# EAGLE schematic 64Pin-2 (EAGLE 7.2.0)
64 Pin Board to mount PIC24FJ1024GB606E
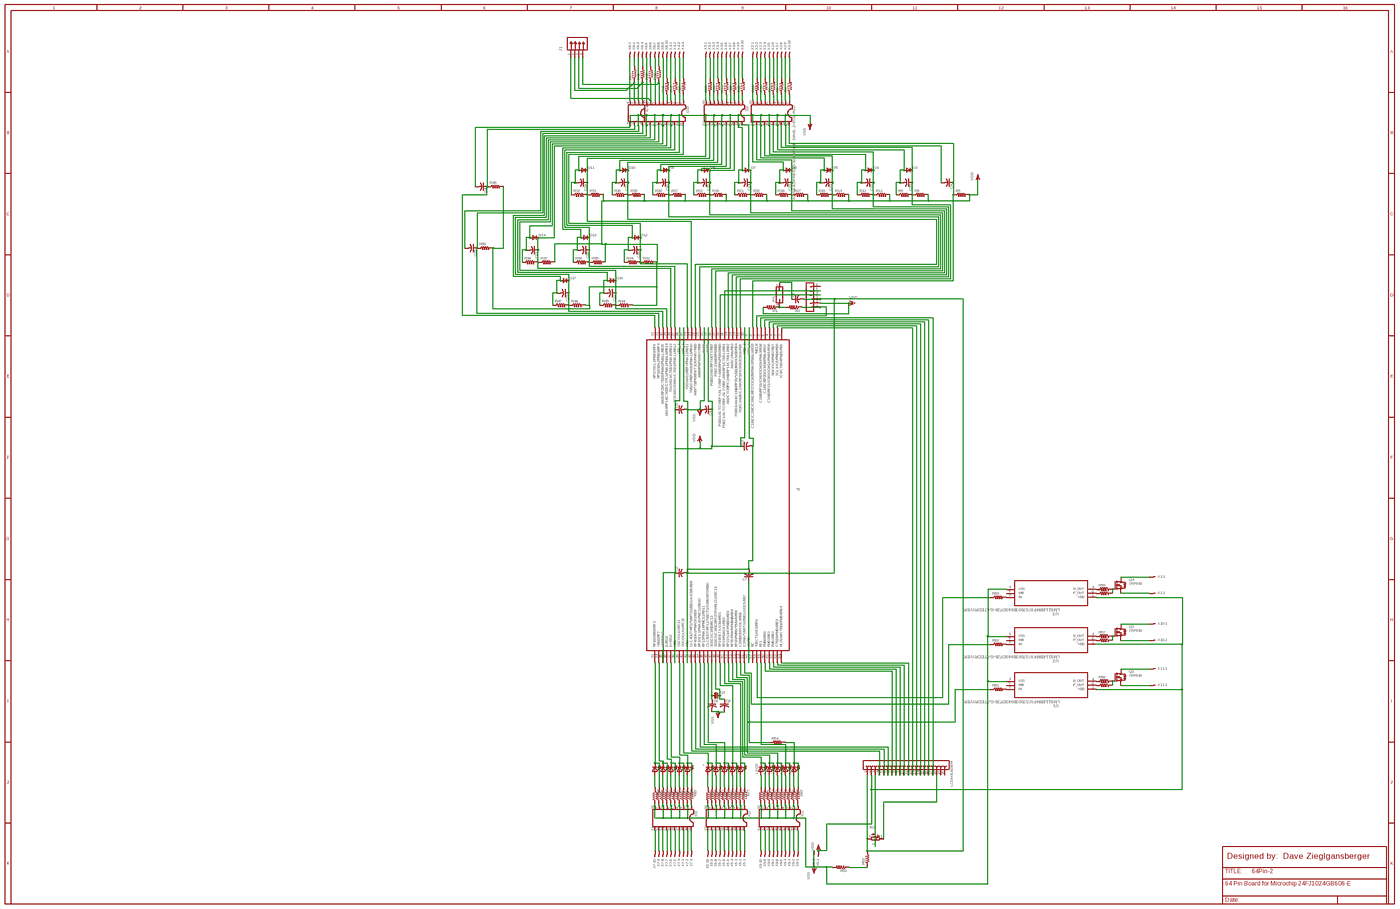
[diagram p0: schematic, sheet 1, overview]
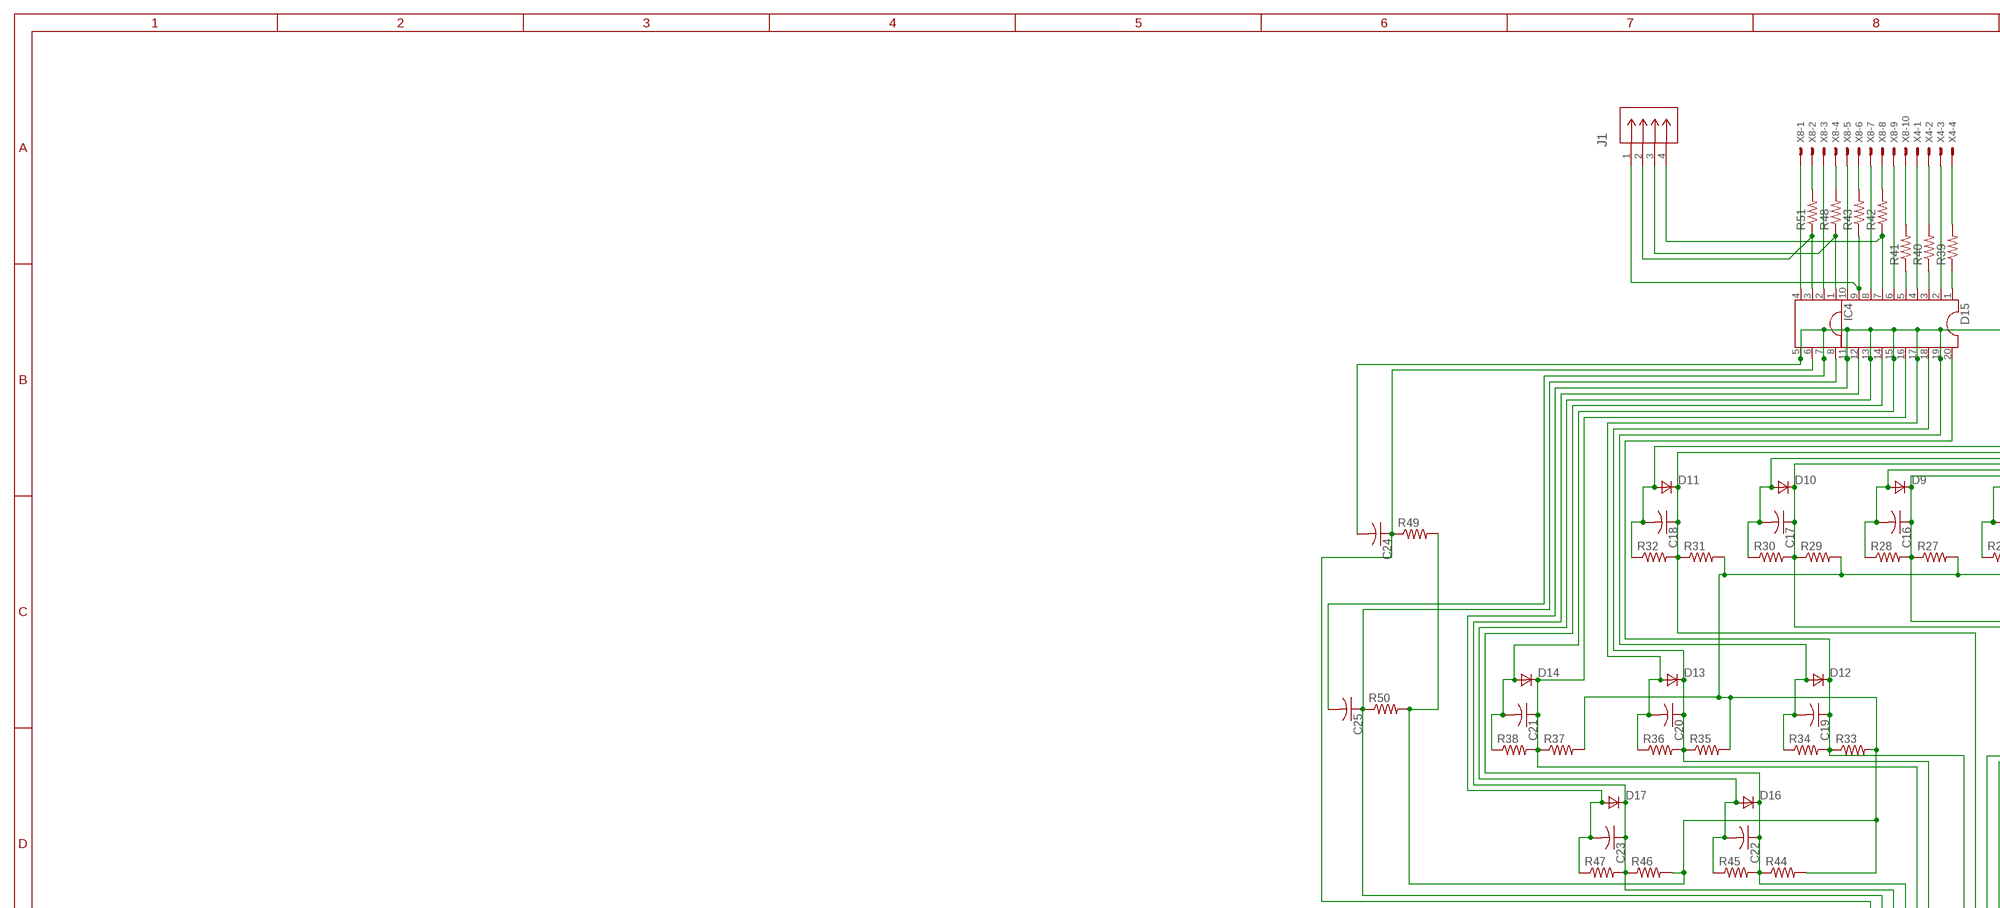
[diagram p1: schematic, sheet 1, part 1 of 4]
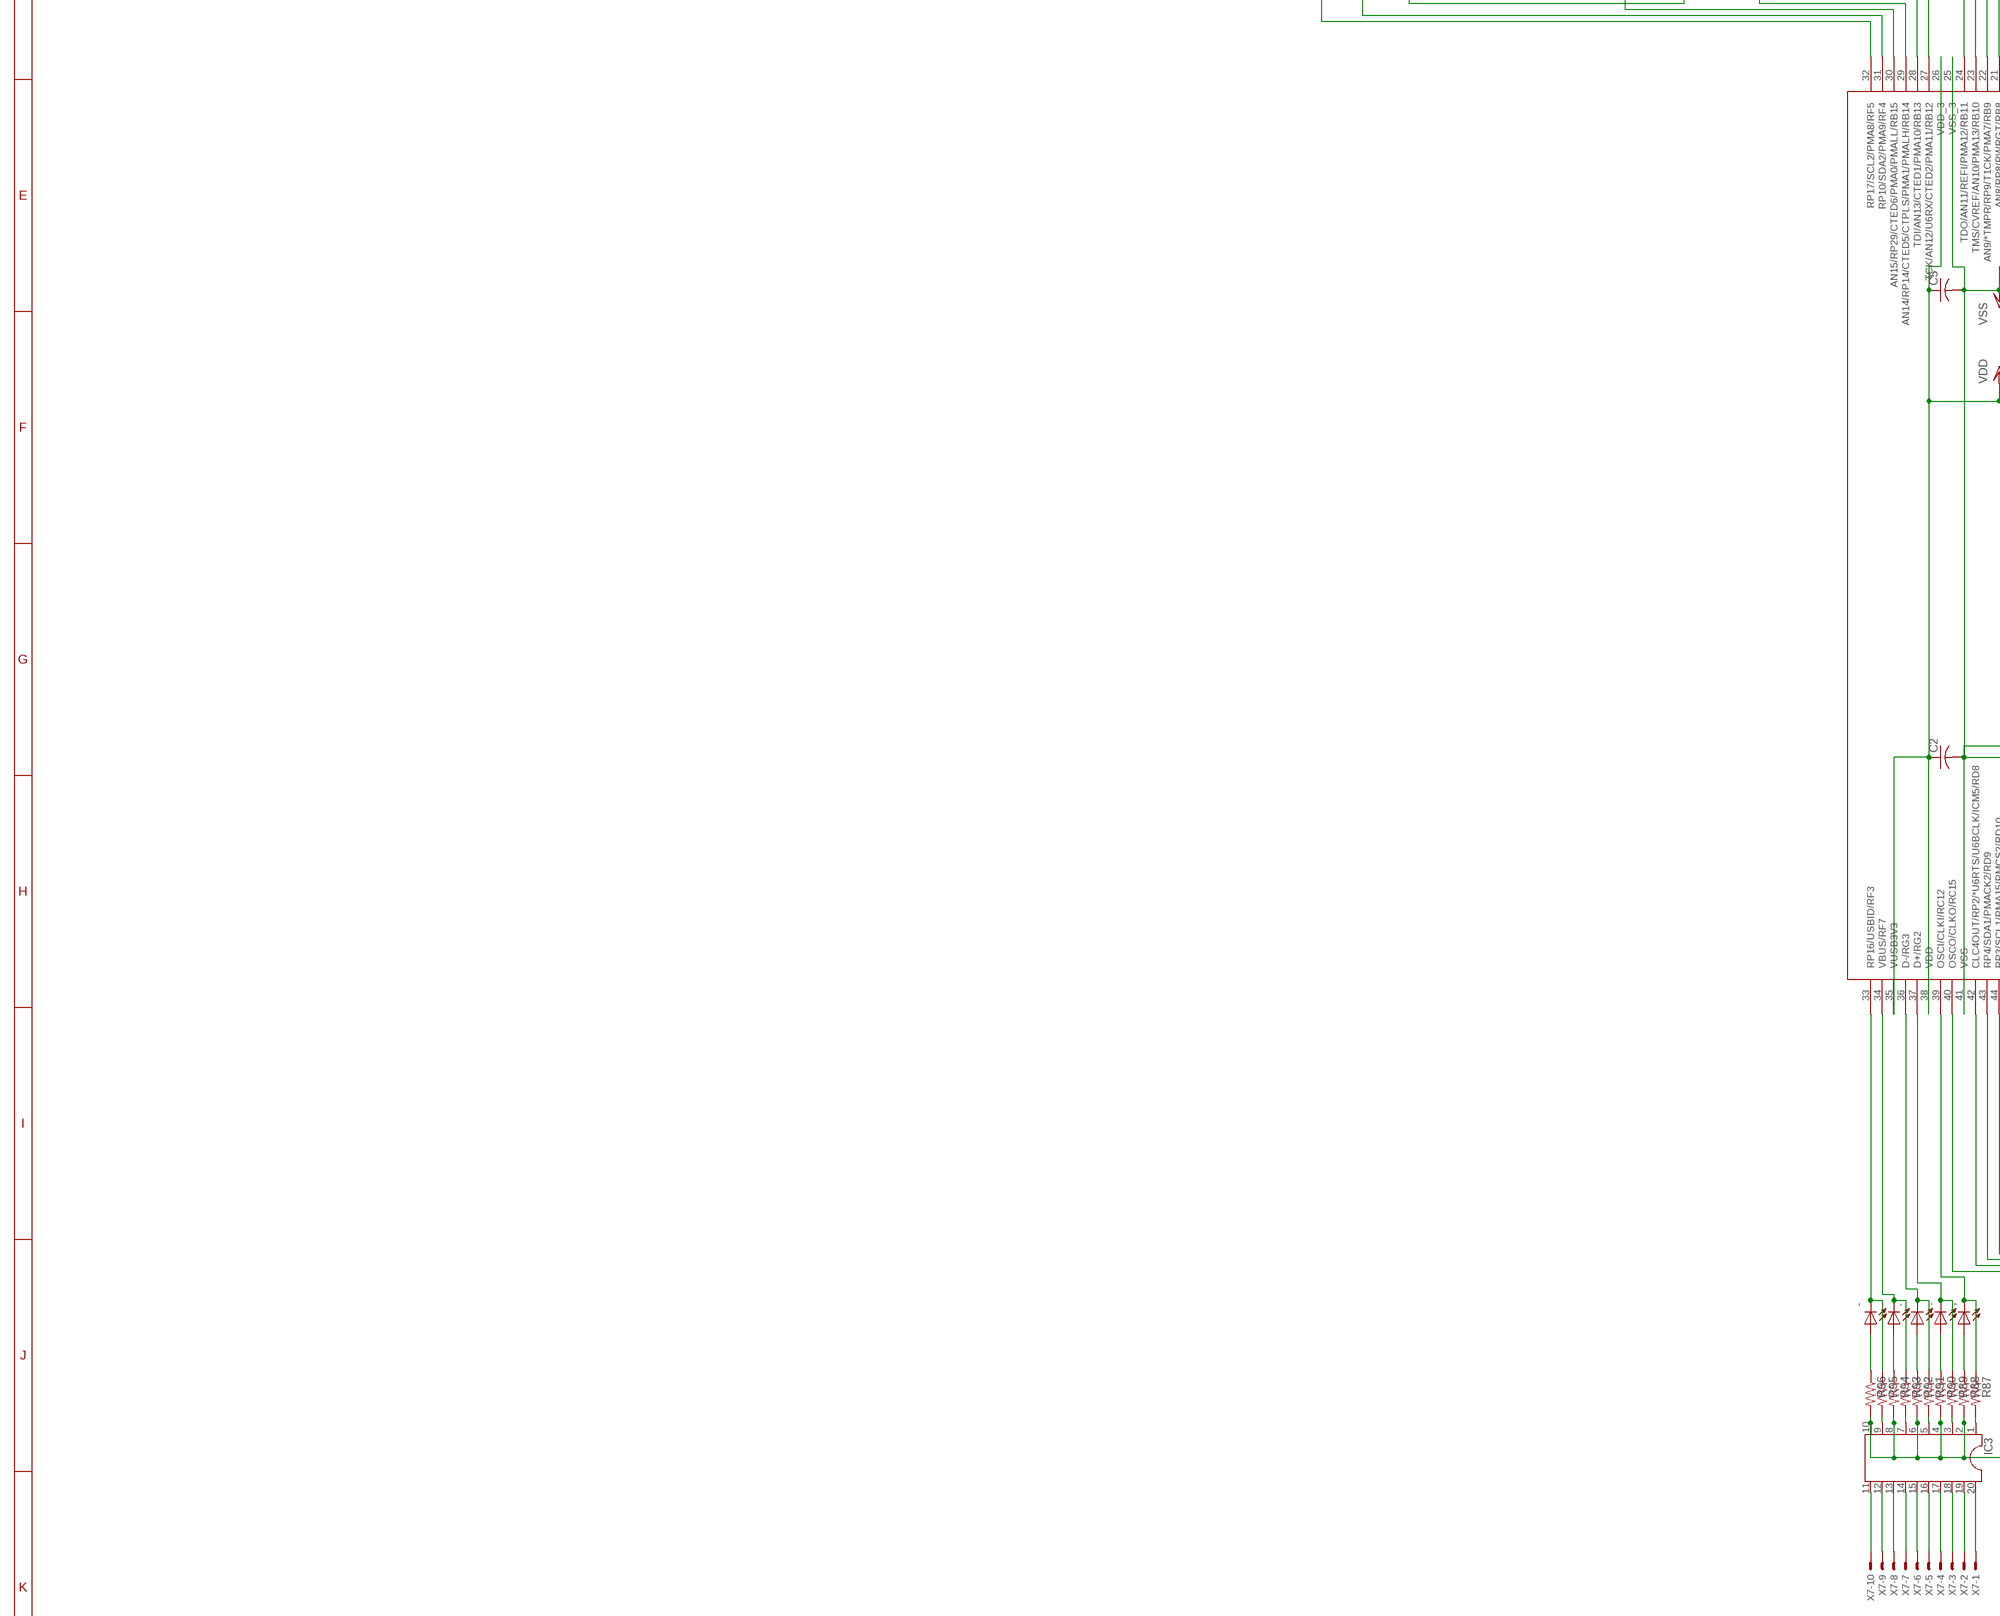
[diagram p2: schematic, sheet 1, part 2 of 4]
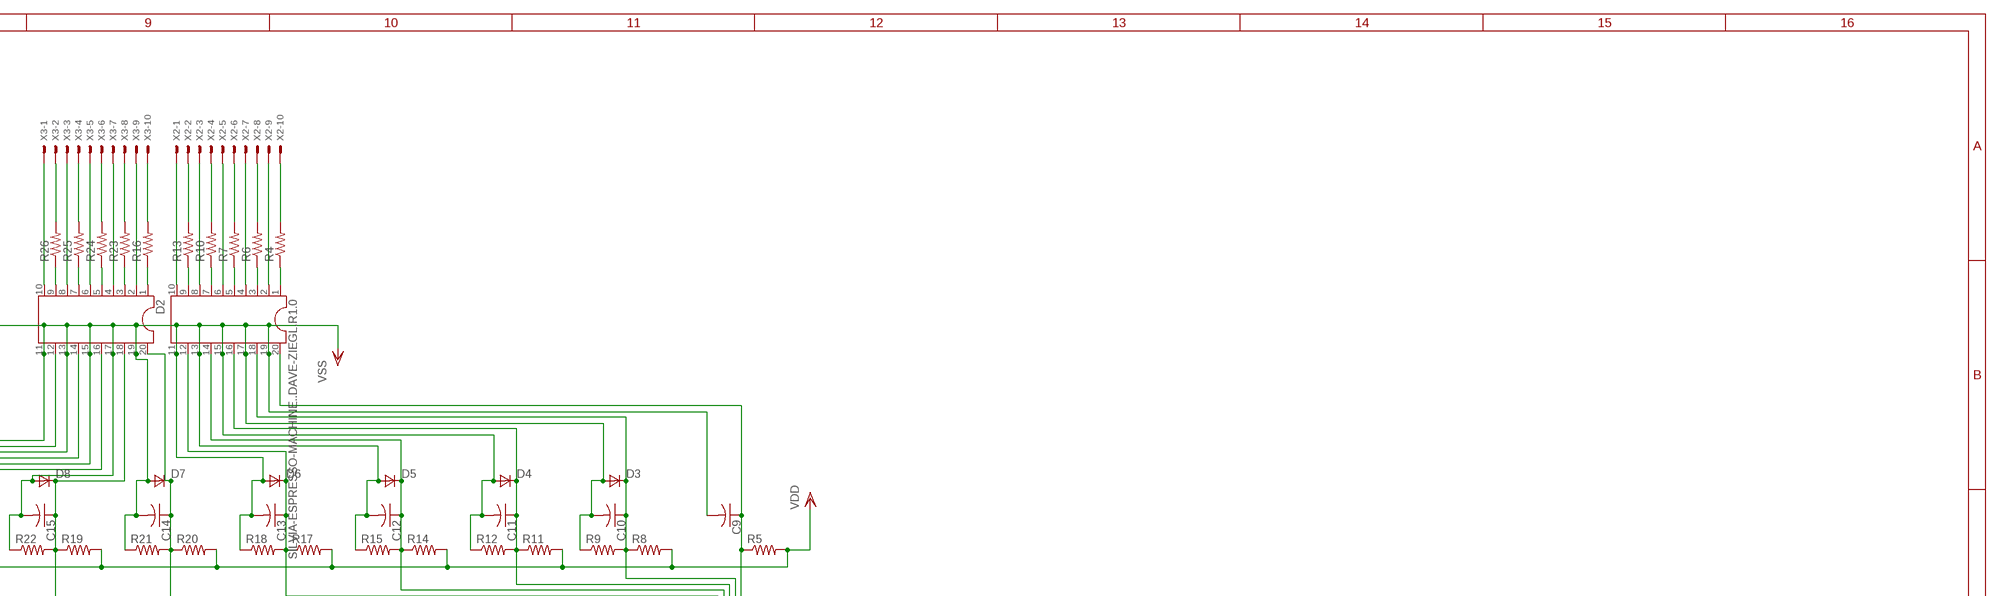
[diagram p3: schematic, sheet 1, part 3 of 4]
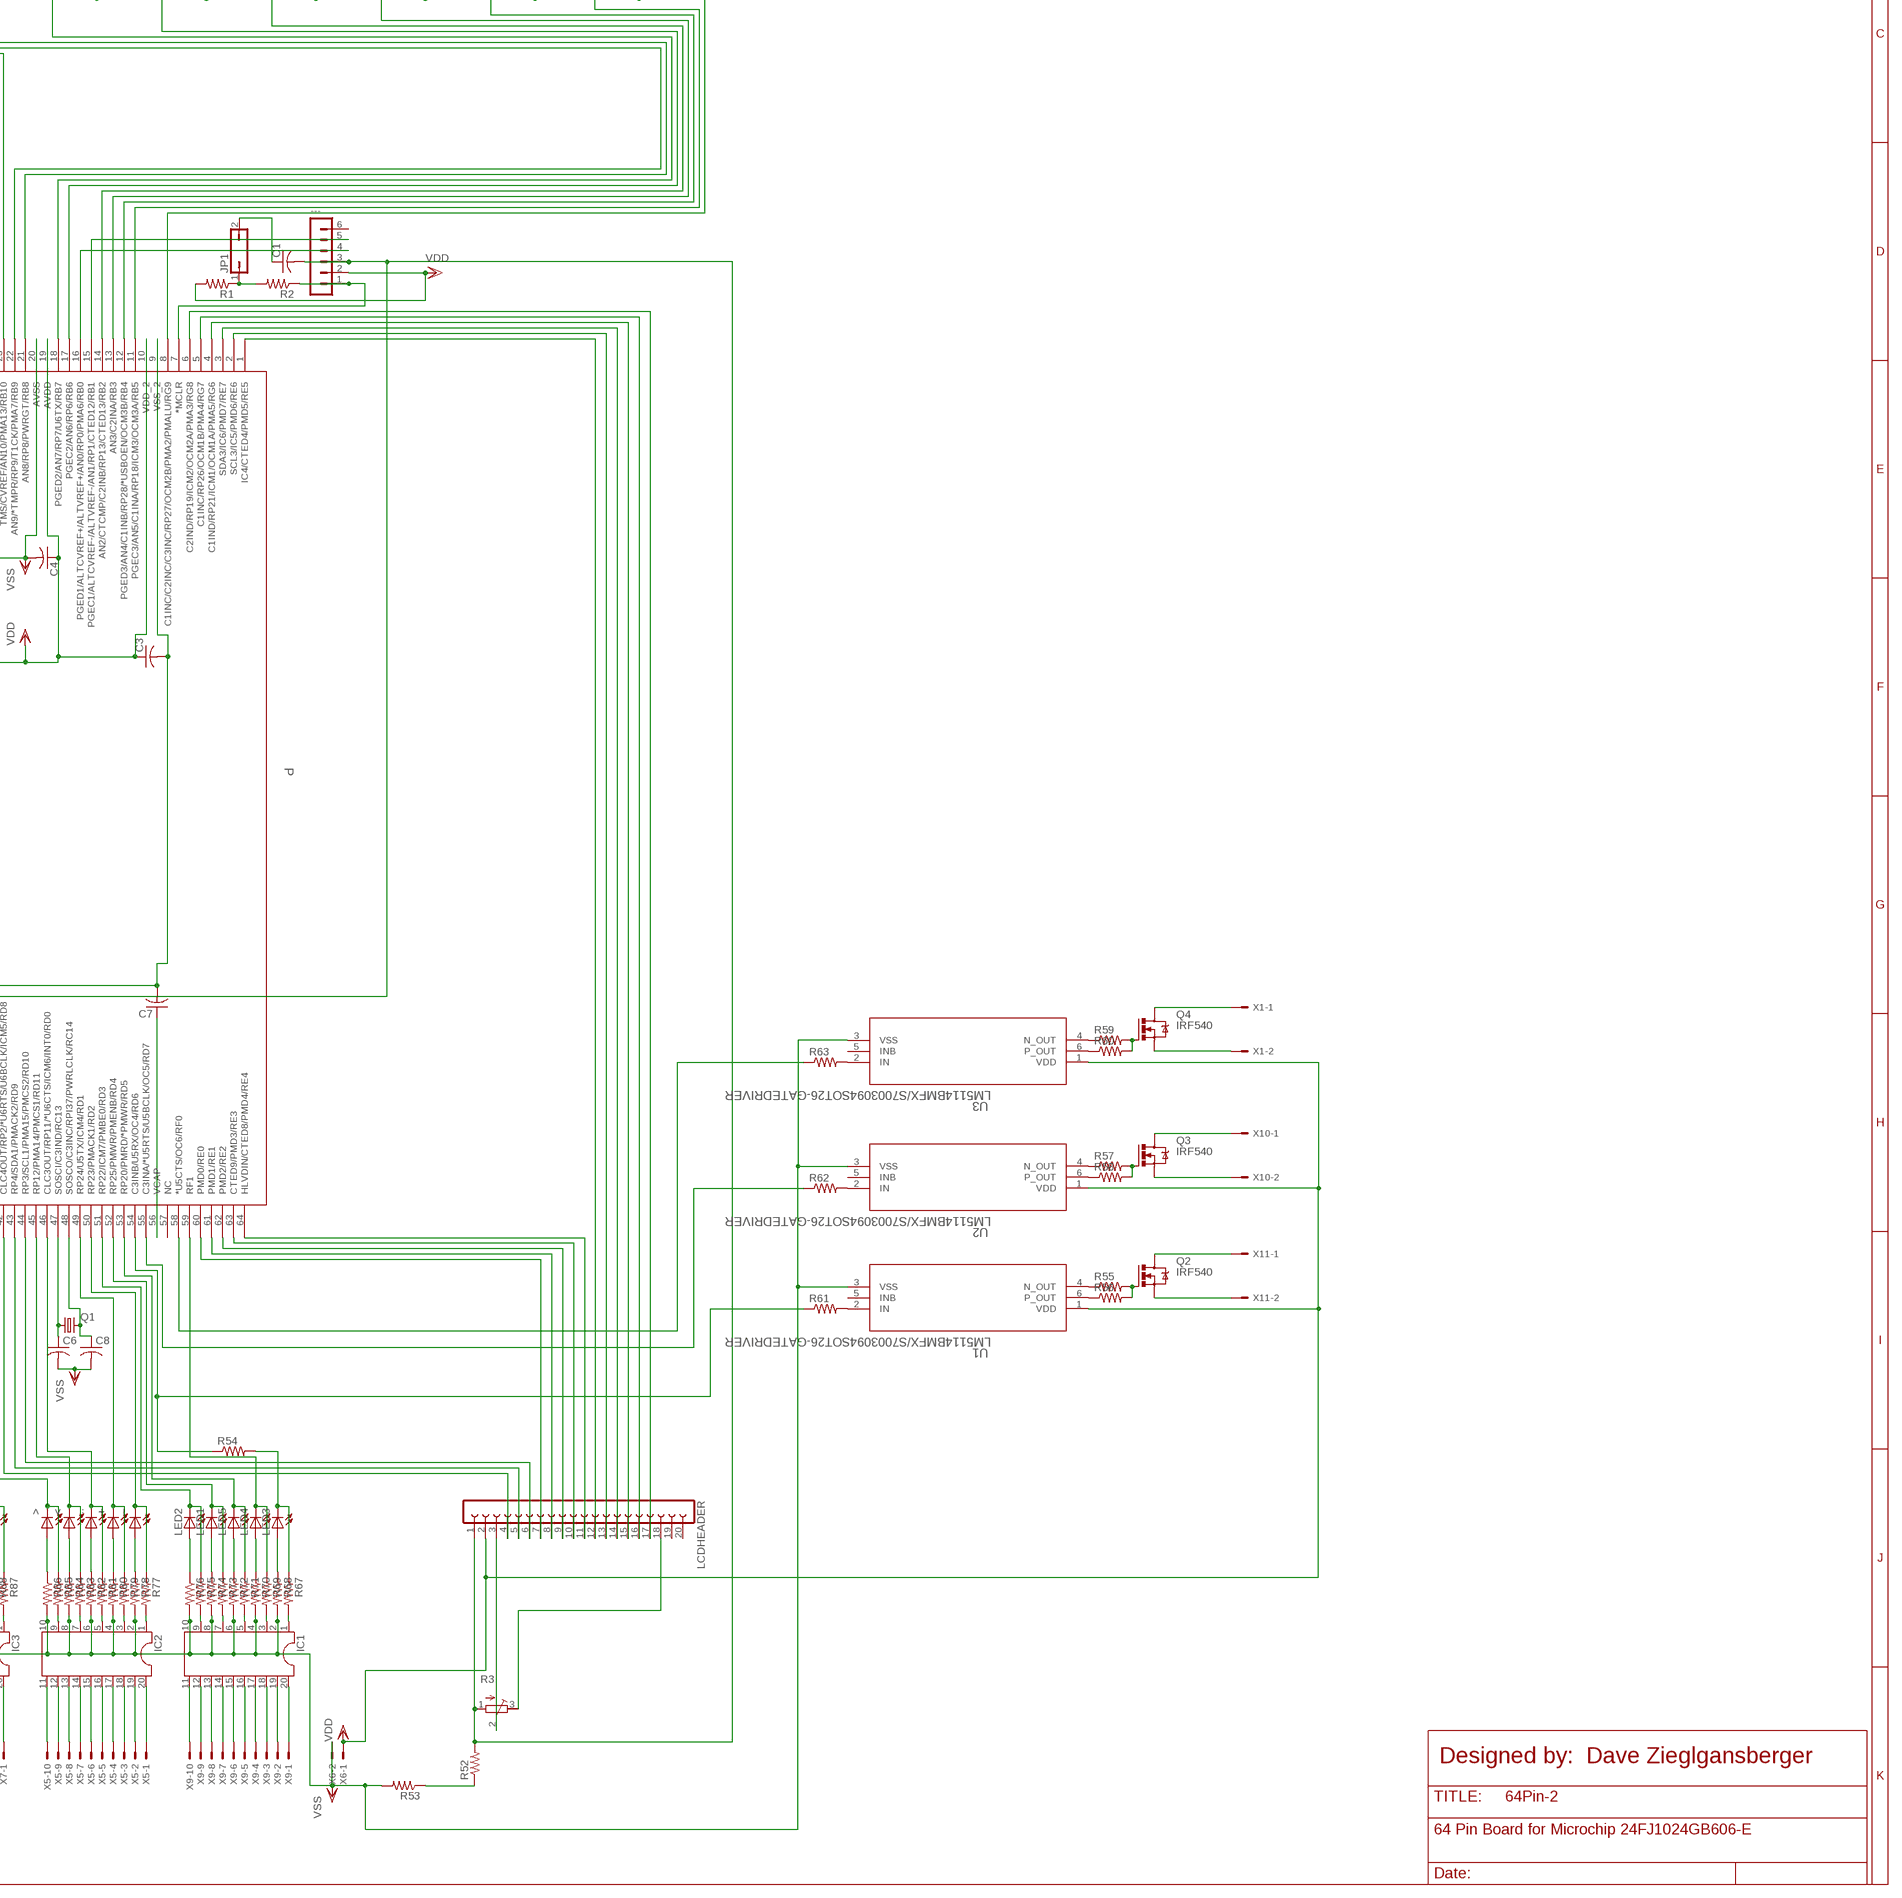
[diagram p4: schematic, sheet 1, part 4 of 4]

## Parts
+  LED_ESML0603  [LED_SML0603]
,  LED_ESML0603  [LED_SML0603]
-  LED_ESML0603  [LED_SML0603]
--  LED_ESML0603  [LED_SML0603]
---  MA06-1  [MA06-1]
.  LED_ESML0603  [LED_SML0603]
..  LED_ESML0603  [LED_SML0603]
<  LED_ESML0603  [LED_SML0603]
>  LED_ESML0603  [LED_SML0603]
`  LED_ESML0603  [LED_SML0603]
C1  C-USC0603  [C0603]
C2  C-USC0603  [C0603]
C3  C-USC0603  [C0603]
C4  C-USC0603  [C0603]
C5  C-USC0603  [C0603]
C6  C-USC0603  [C0603]
C7  C-USC0603  [C0603]
C8  C-USC0603  [C0603]
C9  C-USC0603  [C0603]
C10  C-USC0603  [C0603]
C11  C-USC0603  [C0603]
C12  C-USC0603  [C0603]
C13  C-USC0603  [C0603]
C14  C-USC0603  [C0603]
C15  C-USC0603  [C0603]
C16  C-USC0603  [C0603]
C17  C-USC0603  [C0603]
C18  C-USC0603  [C0603]
C19  C-USC0603  [C0603]
C20  C-USC0603  [C0603]
C21  C-USC0603  [C0603]
C22  C-USC0603  [C0603]
C23  C-USC0603  [C0603]
C24  C-USC0603  [C0603]
C25  C-USC0603  [C0603]
D2  DIL20  [DIL20]
D3  DSOD323  [SOD323]
D4  DSOD323  [SOD323]
D5  DSOD323  [SOD323]
D6  DSOD323  [SOD323]
D7  DSOD323  [SOD323]
D8  DSOD323  [SOD323]
D9  DSOD323  [SOD323]
D10  DSOD323  [SOD323]
D11  DSOD323  [SOD323]
D12  DSOD323  [SOD323]
D13  DSOD323  [SOD323]
D14  DSOD323  [SOD323]
D15  DIL20  [DIL20]
D16  DSOD323  [SOD323]
D17  DSOD323  [SOD323]
IC1  DIL20  [DIL20]
IC2  DIL20  [DIL20]
IC3  DIL20  [DIL20]
IC4  DIL8  [DIL08]
J1  84952-4  [CON4_SMT-RA_FCC-FPC2]
JP1  JP1Q  [JP1]
LCDHEADER  FE20-1  [FE20]
LED1  LED_ESML0603  [LED_SML0603]
LED2  LED_ESML0603  [LED_SML0603]
LED3  LED_ESML0603  [LED_SML0603]
LED4  LED_ESML0603  [LED_SML0603]
LED5  LED_ESML0603  [LED_SML0603]
P  PIC24FJXXXGB606-X_PT  [TQFP64_10X10MC]
Q1  CRYSTALTC26H  [TC26H]
Q2  IRF540  [TO220BV]
Q3  IRF540  [TO220BV]
Q4  IRF540  [TO220BV]
R1  R-US_R0603  [R0603]
R2  R-US_R0603  [R0603]
R3  R-TRIMM3296W  [RTRIM3296W]
R4  R-US_R0603  [R0603]
R5  R-US_R0603  [R0603]
R6  R-US_R0603  [R0603]
R7  R-US_R0603  [R0603]
R8  R-US_R0603  [R0603]
R9  R-US_R0603  [R0603]
R10  R-US_R0603  [R0603]
R11  R-US_R0603  [R0603]
R12  R-US_R0603  [R0603]
R13  R-US_R0603  [R0603]
R14  R-US_R0603  [R0603]
R15  R-US_R0603  [R0603]
R16  R-US_R0603  [R0603]
R17  R-US_R0603  [R0603]
R18  R-US_R0603  [R0603]
R19  R-US_R0603  [R0603]
R20  R-US_R0603  [R0603]
R21  R-US_R0603  [R0603]
R22  R-US_R0603  [R0603]
R23  R-US_R0603  [R0603]
R24  R-US_R0603  [R0603]
R25  R-US_R0603  [R0603]
R26  R-US_R0603  [R0603]
R27  R-US_R0603  [R0603]
R28  R-US_R0603  [R0603]
R29  R-US_R0603  [R0603]
R30  R-US_R0603  [R0603]
R31  R-US_R0603  [R0603]
R32  R-US_R0603  [R0603]
R33  R-US_R0603  [R0603]
R34  R-US_R0603  [R0603]
R35  R-US_R0603  [R0603]
R36  R-US_R0603  [R0603]
R37  R-US_R0603  [R0603]
R38  R-US_R0603  [R0603]
R39  R-US_R0603  [R0603]
R40  R-US_R0603  [R0603]
R41  R-US_R0603  [R0603]
R42  R-US_R0603  [R0603]
R43  R-US_R0603  [R0603]
R44  R-US_R0603  [R0603]
R45  R-US_R0603  [R0603]
R46  R-US_R0603  [R0603]
R47  R-US_R0603  [R0603]
R48  R-US_R0603  [R0603]
R49  R-US_R0603  [R0603]
R50  R-US_R0603  [R0603]
R51  R-US_R0603  [R0603]
R52  R-US_R0603  [R0603]
R53  R-US_R0603  [R0603]
R54  R-US_R0603  [R0603]
R55  R-US_R0603  [R0603]
R56  R-US_R0603  [R0603]
R57  R-US_R0603  [R0603]
R58  R-US_R0603  [R0603]
R59  R-US_R0603  [R0603]
R60  R-US_R0603  [R0603]
R61  R-US_R0603  [R0603]
R62  R-US_R0603  [R0603]
R63  R-US_R0603  [R0603]
R67  R-US_R0603  [R0603]
R68  R-US_R0603  [R0603]
R69  R-US_R0603  [R0603]
R70  R-US_R0603  [R0603]
R71  R-US_R0603  [R0603]
R72  R-US_R0603  [R0603]
R73  R-US_R0603  [R0603]
R74  R-US_R0603  [R0603]
R75  R-US_R0603  [R0603]
R76  R-US_R0603  [R0603]
R77  R-US_R0603  [R0603]
R78  R-US_R0603  [R0603]
R79  R-US_R0603  [R0603]
R80  R-US_R0603  [R0603]
R81  R-US_R0603  [R0603]
R82  R-US_R0603  [R0603]
R83  R-US_R0603  [R0603]
R84  R-US_R0603  [R0603]
R85  R-US_R0603  [R0603]
R86  R-US_R0603  [R0603]
R87  R-US_R0603  [R0603]
R88  R-US_R0603  [R0603]
R89  R-US_R0603  [R0603]
R90  R-US_R0603  [R0603]
R91  R-US_R0603  [R0603]
R92  R-US_R0603  [R0603]
R93  R-US_R0603  [R0603]
R94  R-US_R0603  [R0603]
R95  R-US_R0603  [R0603]
R96  R-US_R0603  [R0603]
SILVIA-ESPRESSO-MACHINE..DAVE-ZIEGL.R1.0  DIL20  [DIL20]
U1  LM5114BMFX/S7003094SOT26-GATEDRIVER  [MF06A]
U2  LM5114BMFX/S7003094SOT26-GATEDRIVER  [MF06A]
U3  LM5114BMFX/S7003094SOT26-GATEDRIVER  [MF06A]
X1  KK-156-2  [KK-156-2]
X2  22-23-2101  [22-23-2101]
X3  22-23-2101  [22-23-2101]
X4  22-23-2041  [22-23-2041]
X5  22-23-2101  [22-23-2101]
X6  22-23-2021  [22-23-2021]
X7  22-23-2101  [22-23-2101]
X8  22-23-2101  [22-23-2101]
X9  22-23-2101  [22-23-2101]
X10  KK-156-2  [KK-156-2]
X11  KK-156-2  [KK-156-2]
~  LED_ESML0603  [LED_SML0603]

## Nets
MCLR: ---.1 P.7(*MCLR) R2.1
N$1: IC4.4 X8.1
N$3: IC3.9 R95.2
N$4: JP1.1 R1.1 R2.2
N$5: R51.2 X8.2
N$6: IC3.7 R93.2
N$7: IC4.2 X8.3
N$8: IC3.5 R91.2
N$11: R48.2 X8.4
N$13: IC3.3 R89.2
N$17: D15.10 X8.5
N$19: IC4.1 J1.3 R48.1
N$20: C1.1 JP1.2
N$21: IC4.3 J1.2 R51.1
N$23: R43.2 X8.6
N$24: D15.8 X8.7
N$25: R42.2 X8.8
N$26: D15.6 X8.9
N$27: IC3.1 R87.2
N$28: R41.2 X8.10
N$29: D15.4 X4.1
N$30: R40.2 X4.2
N$31: D15.2 X4.3
N$32: R39.2 X4.4
N$33: R57.1 U2.4(N_OUT)
N$34: R58.1 U2.6(P_OUT)
N$35: R55.1 U1.4(N_OUT)
N$36: -.A R96.1
N$37: --.A R94.1
N$38: `.A R92.1
N$39: ..A R90.1
N$40: ,.A R88.1
N$41: R56.1 U1.6(P_OUT)
N$42: >.A R86.1
N$43: IC2.9 R85.2
N$44: SILVIA-ESPRESSO-MACHINE..DAVE-ZIEGL.R1.0.6 X2.5
N$45: R10.2 X2.4
N$46: R52.1 R53.1
N$47: IC2.7 R83.2
N$48: Q2.G R55.2 R56.2
N$49: IC2.5 R81.2
N$50: Q3.G R57.2 R58.2
N$51: IC2.3 R79.2
N$52: R59.1 U3.4(N_OUT)
N$53: IC2.1 R77.2
N$54: R10.1 SILVIA-ESPRESSO-MACHINE..DAVE-ZIEGL.R1.0.7
N$55: R78.1 ~.A
N$56: +.A R80.1
N$57: ...A R82.1
N$58: <.A R84.1
N$59: R60.1 U3.6(P_OUT)
N$60: IC1.9 R75.2
N$61: Q4.G R59.2 R60.2
N$62: IC1.7 R73.2
N$63: Q4.D X1.1
N$64: IC1.5 R71.2
N$65: Q4.S X1.2
N$66: IC1.3 R69.2
N$67: Q3.D X10.1
N$68: IC1.1 R67.2
N$69: LED3.A R68.1
N$70: LED4.A R70.1
N$71: LED5.A R72.1
N$72: LED1.A R74.1
N$73: LED2.A R76.1
N$74: Q3.S X10.2
N$75: Q2.D X11.1
N$76: Q2.S X11.2
N$77: R61.2 U1.2(IN)
N$78: R62.2 U2.2(IN)
N$79: R63.2 U3.2(IN)
N$80: P.55(C3INA/*U5RTS/U5BCLK/OC5/RD7) R62.1
N$81: P.58(*U5CTS/OC6/RF0) R63.1
N$84: D15.9 J1.1 R43.1
N$87: D15.7 J1.4 R42.1
N$90: D15.5 R41.1
N$93: D15.3 R40.1
N$95: D15.1 R39.1
N$96: D2.10 X3.1
N$98: D2.9 R26.1
N$99: D2.8 X3.3
N$100: R26.2 X3.2
N$101: R25.2 X3.4
N$102: D2.6 X3.5
N$103: D2.7 R25.1
N$104: D2.4 X3.7
N$105: D2.3 R23.1
N$106: R23.2 X3.8
N$107: D2.2 X3.9
N$108: D2.1 R16.1
N$109: R16.2 X3.10
N$110: SILVIA-ESPRESSO-MACHINE..DAVE-ZIEGL.R1.0.10 X2.1
N$111: R13.2 X2.2
N$112: R13.1 SILVIA-ESPRESSO-MACHINE..DAVE-ZIEGL.R1.0.9
N$113: SILVIA-ESPRESSO-MACHINE..DAVE-ZIEGL.R1.0.8 X2.3
N$114: D2.5 R24.1
N$115: R24.2 X3.6
N$116: R7.2 X2.6
N$117: R7.1 SILVIA-ESPRESSO-MACHINE..DAVE-ZIEGL.R1.0.5
N$118: SILVIA-ESPRESSO-MACHINE..DAVE-ZIEGL.R1.0.4 X2.7
N$119: R6.2 X2.8
N$120: R6.1 SILVIA-ESPRESSO-MACHINE..DAVE-ZIEGL.R1.0.3
N$121: SILVIA-ESPRESSO-MACHINE..DAVE-ZIEGL.R1.0.2 X2.9
N$122: R4.2 X2.10
N$123: R4.1 SILVIA-ESPRESSO-MACHINE..DAVE-ZIEGL.R1.0.1
N$149: LCDHEADER.3 R3.2(S)
N$151: LCDHEADER.18 R3.3(E)
OUT: LED3.C R54.2 R67.1
OUT1-1: IC3.11 X7.10
OUT1-2 [Output Traces]: IC3.12 X7.9
OUT2-1: IC3.13 X7.8
OUT2-2: IC3.14 X7.7
OUT3-1: IC3.15 X7.6
OUT3-2: IC3.16 X7.5
OUT4-1: IC3.17 X7.4
OUT4-2: IC3.18 X7.3
OUT5-1: IC3.19 X7.2
OUT5-2: IC3.20 X7.1
OUT6-1: IC2.11 X5.10
OUT6-2: IC2.12 X5.9
OUT7-1: IC2.13 X5.8
OUT7-2: IC2.14 X5.7
OUT8-1: IC2.15 X5.6
OUT8-2: IC2.16 X5.5
OUT9-1: IC2.17 X5.4
OUT9-2: IC2.18 X5.3
OUT10-1: IC2.19 X5.2
OUT10-2: IC2.20 X5.1
OUT11-1: IC1.11 X9.10
OUT11-2: IC1.12 X9.9
OUT12-1: IC1.13 X9.8
OUT12-2: IC1.14 X9.7
OUT13-1: IC1.15 X9.6
OUT13-2: IC1.16 X9.5
OUT14-1: IC1.17 X9.4
OUT14-2: IC1.18 X9.3
OUT15-1: IC1.19 X9.2
OUT15-2: IC1.20 X9.1
PGEC1: ---.5 P.15(PGEC1/ALTCVREF-/ALTVREF-/AN1/RP1/CTED12/RB1)
PGECD: ---.4 P.16(PGED1/ALTCVREF+/ALTVREF+/AN0/RP0/PMA6/RB0)
PIN1: LCDHEADER.12 P.1(IC4/CTED4/PMD5/RE5)
PIN2: LCDHEADER.13 P.2(SCL3/IC5/PMD6/RE6)
PIN3: LCDHEADER.14 P.3(SDA3/IC6/PMD7/RE7)
PIN4: LCDHEADER.15 P.4(C1IND/RP21/ICM1/OCM1A/PMA5/RG6)
PIN5: LCDHEADER.16 P.5(C1INC/RP26/OCM1B/PMA4/RG7)
PIN6: LCDHEADER.17 P.6(C2IND/RP19/ICM2/OCM2A/PMA3/RG8)
PIN8: C9.1 P.8(C1INC/C2INC/C3INC/RP27/OCM2B/PMA2/PMALU/RG9) R5.1 SILVIA-ESPRESSO-MACHINE..DAVE-ZIEGL.R1.0.20
PIN11: C10.1 D3.1(C) P.11(PGEC3/AN5/C1INA/RP18/ICM3/OCM3A/RB5) R8.1 R9.2 SILVIA-ESPRESSO-MACHINE..DAVE-ZIEGL.R1.0.18
PIN12: C11.1 D4.1(C) P.12(PGED3/AN4/C1INB/RP28/*USBOEN/OCM3B/RB4) R11.1 R12.2 SILVIA-ESPRESSO-MACHINE..DAVE-ZIEGL.R1.0.16
PIN13: C12.1 D5.1(C) P.13(AN3/C2INA/RB3) R14.1 R15.2 SILVIA-ESPRESSO-MACHINE..DAVE-ZIEGL.R1.0.14
PIN14: C13.1 D6.1(C) P.14(AN2/CTCMP/C2INB/RP13/CTED13/RB2) R17.1 R18.2 SILVIA-ESPRESSO-MACHINE..DAVE-ZIEGL.R1.0.12
PIN17: C14.1 D2.20 D7.1(C) P.17(PGEC2/AN6/RP6/RB6) R20.1 R21.2
PIN18: C15.1 D2.18 D8.1(C) P.18(PGED2/AN7/RP7/U6TX/RB7) R19.1 R22.2
PIN21: C16.1 D2.16 D9.1(C) P.21(AN8/RP8/PWRGT/RB8) R27.1 R28.2
PIN22: C17.1 D2.14 D10.1(C) P.22(AN9/*TMPR/RP9/T1CK/PMA7/RB9) R29.1 R30.2
PIN23: C18.1 D2.12 D11.1(C) P.23(TMS/CVREF/AN10/PMA13/RB10) R31.1 R32.2
PIN24: C19.1 D12.1(C) D15.20 P.24(TDO/AN11/REFI/PMA12/RB11) R33.1 R34.2
PIN27: C20.1 D13.1(C) D15.18 P.27(TCK/AN12/U6RX/CTED2/PMA11/RB12) R35.1 R36.2
PIN28: C21.1 D14.1(C) D15.16 P.28(TDI/AN13/CTED1/PMA10/RB13) R37.1 R38.2
PIN29: C22.1 D15.14 D16.1(C) P.29(AN14/RP14/CTED5/CTPLS/PMA1/PMALH/RB14) R44.1 R45.2
PIN30: C23.1 D15.12 D17.1(C) P.30(AN15/RP29/CTED6/PMA0/PMALL/RB15) R46.1 R47.2
PIN31: C25.1 IC4.8 P.31(RP10/SDA2/PMA9/RF4) R50.1
PIN32: C24.1 IC4.6 P.32(RP17/SCL2/PMA8/RF5) R49.1
PIN33: -.C P.33(RP16/USBID/RF3) R95.1
PIN34: --.C P.34(VBUS/RF7) R93.1
PIN36: `.C P.36(D-/RG3) R91.1
PIN37: ..C P.37(D+/RG2) R89.1
PIN39: ,.C P.39(OSCI/CLKI/RC12) R87.1
PIN40: >.C P.40(OSCO/CLKO/RC15) R85.1
PIN42: LCDHEADER.4 P.42(CLC4OUT/RP2/*U6RTS/U6BCLK/ICM5/RD8)
PIN43: LCDHEADER.5 P.43(RP4/SDA1/PMACK2/RD9)
PIN44: LCDHEADER.6 P.44(RP3/SCL1/PMA15/PMCS2/RD10)
PIN45: <.C P.45(RP12/PMA14/PMCS1/RD11) R83.1
PIN46: ...C P.46(CLC3OUT/RP11/*U6CTS/ICM6/INT0/RD0) R81.1
PIN49: +.C P.49(RP24/U5TX/ICM4/RD1) R79.1
PIN50: P.50(RP23/PMACK1/RD2) R77.1 ~.C
PIN51: LED2.C P.51(RP22/ICM7/PMBE0/RD3) R75.1
PIN52: LED1.C P.52(RP25/PMWR/PMENB/RD4) R73.1
PIN53: LED5.C P.53(RP20/PMRD/*PMWR/RD5) R71.1
PIN54: P.54(C3INB/U5RX/OC4/RD6) R54.1 R61.1
PIN59: LED4.C P.59(RF1) R69.1
PIN60: LCDHEADER.7 P.60(PMD0/RE0)
PIN61: LCDHEADER.8 P.61(PMD1/RE1)
PIN62: LCDHEADER.9 P.62(PMD2/RE2)
PIN63: LCDHEADER.10 P.63(CTED9/PMD3/RE3)
PIN64: LCDHEADER.11 P.64(HLVDIN/CTED8/PMD4/RE4)
SOSCI: C6.1 P.47(SOSCI/C3IND/RC13) Q1.1
SOSCO: C8.1 P.48(SOSCO/C3INC/RPI37/PWRLCLK/RC14) Q1.2
VCAP: C7.1 P.56(VCAP)
VDD [VDD]: ---.2 C2.1 C3.1 C4.1 C5.1 LCDHEADER.2 P.10(VDD_2) P.19(AVDD) P.26(VDD_3) P.35(VUSB3V3) P.38(VDD) R1.2 R5.2 R8.2 R11.2 R14.2 R17.2 R19.2 R20.2 R27.2 R29.2 R31.2 R33.2 R35.2 R37.2 R44.2 R46.2 R49.2 R50.2 U1.1(VDD) U2.1(VDD) U3.1(VDD) X6.1
VSS [VSS]: ---.3 C1.2 C2.2 C3.2 C4.2 C5.2 C6.2 C7.2 C8.2 C9.2 C10.2 C11.2 C12.2 C13.2 C14.2 C15.2 C16.2 C17.2 C18.2 C19.2 C20.2 C21.2 C22.2 C23.2 C24.2 C25.2 D2.11 D2.13 D2.15 D2.17 D2.19 D3.2(A) D4.2(A) D5.2(A) D6.2(A) D7.2(A) D8.2(A) D9.2(A) D10.2(A) D11.2(A) D12.2(A) D13.2(A) D14.2(A) D15.11 D15.13 D15.15 D15.17 D15.19 D16.2(A) D17.2(A) IC1.2 IC1.4 IC1.6 IC1.8 IC1.10 IC2.2 IC2.4 IC2.6 IC2.8 IC2.10 IC3.2 IC3.4 IC3.6 IC3.8 IC3.10 IC4.5 IC4.7 LCDHEADER.1 P.9(VSS_2) P.20(AVSS) P.25(VSS_3) P.41(VSS) R3.1(A) R9.1 R12.1 R15.1 R18.1 R21.1 R22.1 R28.1 R30.1 R32.1 R34.1 R36.1 R38.1 R45.1 R47.1 R52.2 R53.2 R68.2 R70.2 R72.2 R74.2 R76.2 R78.2 R80.2 R82.2 R84.2 R86.2 R88.2 R90.2 R92.2 R94.2 R96.2 SILVIA-ESPRESSO-MACHINE..DAVE-ZIEGL.R1.0.11 SILVIA-ESPRESSO-MACHINE..DAVE-ZIEGL.R1.0.13 SILVIA-ESPRESSO-MACHINE..DAVE-ZIEGL.R1.0.15 SILVIA-ESPRESSO-MACHINE..DAVE-ZIEGL.R1.0.17 SILVIA-ESPRESSO-MACHINE..DAVE-ZIEGL.R1.0.19 U1.3(VSS) U2.3(VSS) U3.3(VSS) X6.2
Unconnected: ---.6 LCDHEADER.19 LCDHEADER.20 P.57(NC) U1.5(INB) U2.5(INB) U3.5(INB)

## Library data of the parts
+ , - -- . .. < > ` LED1-LED5 ~ = eagle-ltspice:LED_E: LED Source: http://www.osram.convergy.de Source: www.luxeon.com Source: www.kingbright.com; SPICEMODEL: NONE; SPICEPREFIX: D; SPICETYPE: diode
--- = con-lstb:MA06-1: PIN HEADER; OC_FARNELL: unknown; OC_NEWARK: unknown
C1-C25 = rcl:C-US: CAPACITOR, American symbol
D2 D15 IC1-IC3 SILVIA-ESPRESSO-MACHINE..DAVE-ZIEGL.R1.0 = ic-package:DIL20: Dual In Line / Socket
D3-D14 D16 D17 = zetex:D: DIODE; MPN: CDSOD323-T05C; OC_FARNELL: 1824860; OC_NEWARK: 79R6078
IC4 = ic-package:DIL8: Dual In Line / Socket
J1 = ZIF-4:84952-4; MANUFACTURER_PART_NUMBER: 849524; VENDOR: Tyco Electronics
JP1 = jumper:JP1Q: JUMPER
LCDHEADER = con-lsta:FE20-1: FEMALE HEADER; OC_FARNELL: unknown; OC_NEWARK: unknown
P = 24FJ1024GB606PT:PIC24FJXXXGB606-X_PT; MANUFACTURER_PART_NUMBER: pic24fjxxxgb606-x_pt; VENDOR: Microchip
Q1 = crystal:CRYSTAL: CRYSTAL; MF: 32.768KHz; OC_FARNELL: unknown; OC_NEWARK: unknown
Q2-Q4 = transistor-power:IRF540: HEXFET Power MOSFET
R1 R2 R4-R63 R67-R96 = resistor:R-US_: RESISTOR, American symbol
R3 = rcl:R-TRIMM: Trimm resistor
U1-U3 = SOT26:LM5114BMFX/S7003094: SOT26 Gate Driver
X1 X10 X11 = con-molex:KK-156-2: KK 156 HEADER Source: http://www.molex.com/pdm_docs/sd/026604100_sd.pdf; OC_FARNELL: unknown; OC_NEWARK: unknown
X2 X3 X5 X7-X9 = con-molex:22-23-2101: .100" (2.54mm) Center Header - 10 Pin; MF: MOLEX; MPN: 22-23-2101; OC_FARNELL: 1756828; OC_NEWARK: 94C0765
X4 = con-molex:22-23-2041: .100" (2.54mm) Center Header - 4 Pin; MF: MOLEX; MPN: 22-23-2041; OC_FARNELL: 1462920; OC_NEWARK: 38C0355
X6 = con-molex:22-23-2021: .100" (2.54mm) Center Header - 2 Pin; MF: MOLEX; MPN: 22-23-2021; OC_FARNELL: 1462926; OC_NEWARK: 25C3832

## Net classes
0 default: width 0.254 mm, clearance 0.205 mm
1 VDD: width 0.254 mm
2 VSS: width 0.254 mm
3 Output Traces: width 0.508 mm